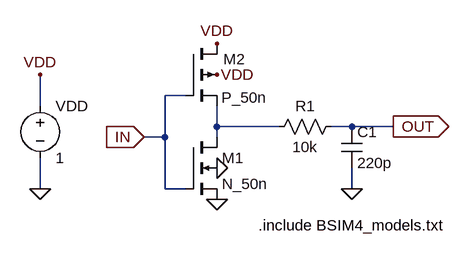
[diagram p0: schematic CMOS.asc]
CMOS.asc, the LTspice schematic file:
Version 4
SHEET 1 880 680
WIRE 48 208 16 208
WIRE -176 224 -176 176
WIRE 96 256 96 224
WIRE 192 256 96 256
WIRE 304 256 272 256
WIRE 368 256 304 256
WIRE 16 272 16 208
WIRE 16 272 -16 272
WIRE 96 272 96 256
WIRE -176 352 -176 304
WIRE 16 352 16 272
WIRE 48 352 16 352
WIRE 304 352 304 320
FLAG -176 176 VDD
FLAG 96 128 VDD
FLAG 96 176 VDD
FLAG -176 352 0
FLAG 96 368 0
FLAG 96 320 0
FLAG -16 272 IN
IOPIN -16 272 In
FLAG 368 256 OUT
IOPIN 368 256 Out
FLAG 304 352 0
SYMBOL pmos4 48 128 R0
WINDOW 0 58 24 Left 2
WINDOW 3 55 83 Left 2
SYMATTR InstName M2
SYMATTR Value P_50n
SYMATTR Value2 l=50n w=1u
SYMBOL nmos4 48 272 R0
SYMATTR InstName M1
SYMATTR Value N_50n
SYMATTR Value2 l=50n w=500n
SYMBOL voltage -176 208 R0
WINDOW 123 0 0 Left 0
WINDOW 39 0 0 Left 0
SYMATTR InstName VDD
SYMATTR Value 1
SYMBOL res 288 240 R90
WINDOW 0 0 56 VBottom 2
WINDOW 3 32 56 VTop 2
SYMATTR InstName R1
SYMATTR Value 10k
SYMBOL cap 288 256 R0
SYMATTR InstName C1
SYMATTR Value 220p
TEXT 160 408 Left 2 !.include BSIM4_models.txt

The netlist it stands for:
* CMOS.asc
M2 VDD IN N001 VDD P_50n l=50n w=1u
M1 N001 IN 0 0 N_50n l=50n w=500n
VDD VDD 0 1
R1 OUT N001 10k
C1 OUT 0 220p
.model NMOS NMOS
.model PMOS PMOS
.lib standard.mos
.include BSIM4_models.txt
.backanno
.end